# EAGLE design NoteIt (EAGLE 9.6.2)
AUTHOR: Tiago Silva; IGNORE_RENUMBER: TP; SOURCE: github.com/TiagoPaulaSilva/NoteIt; VERSION: 2.0
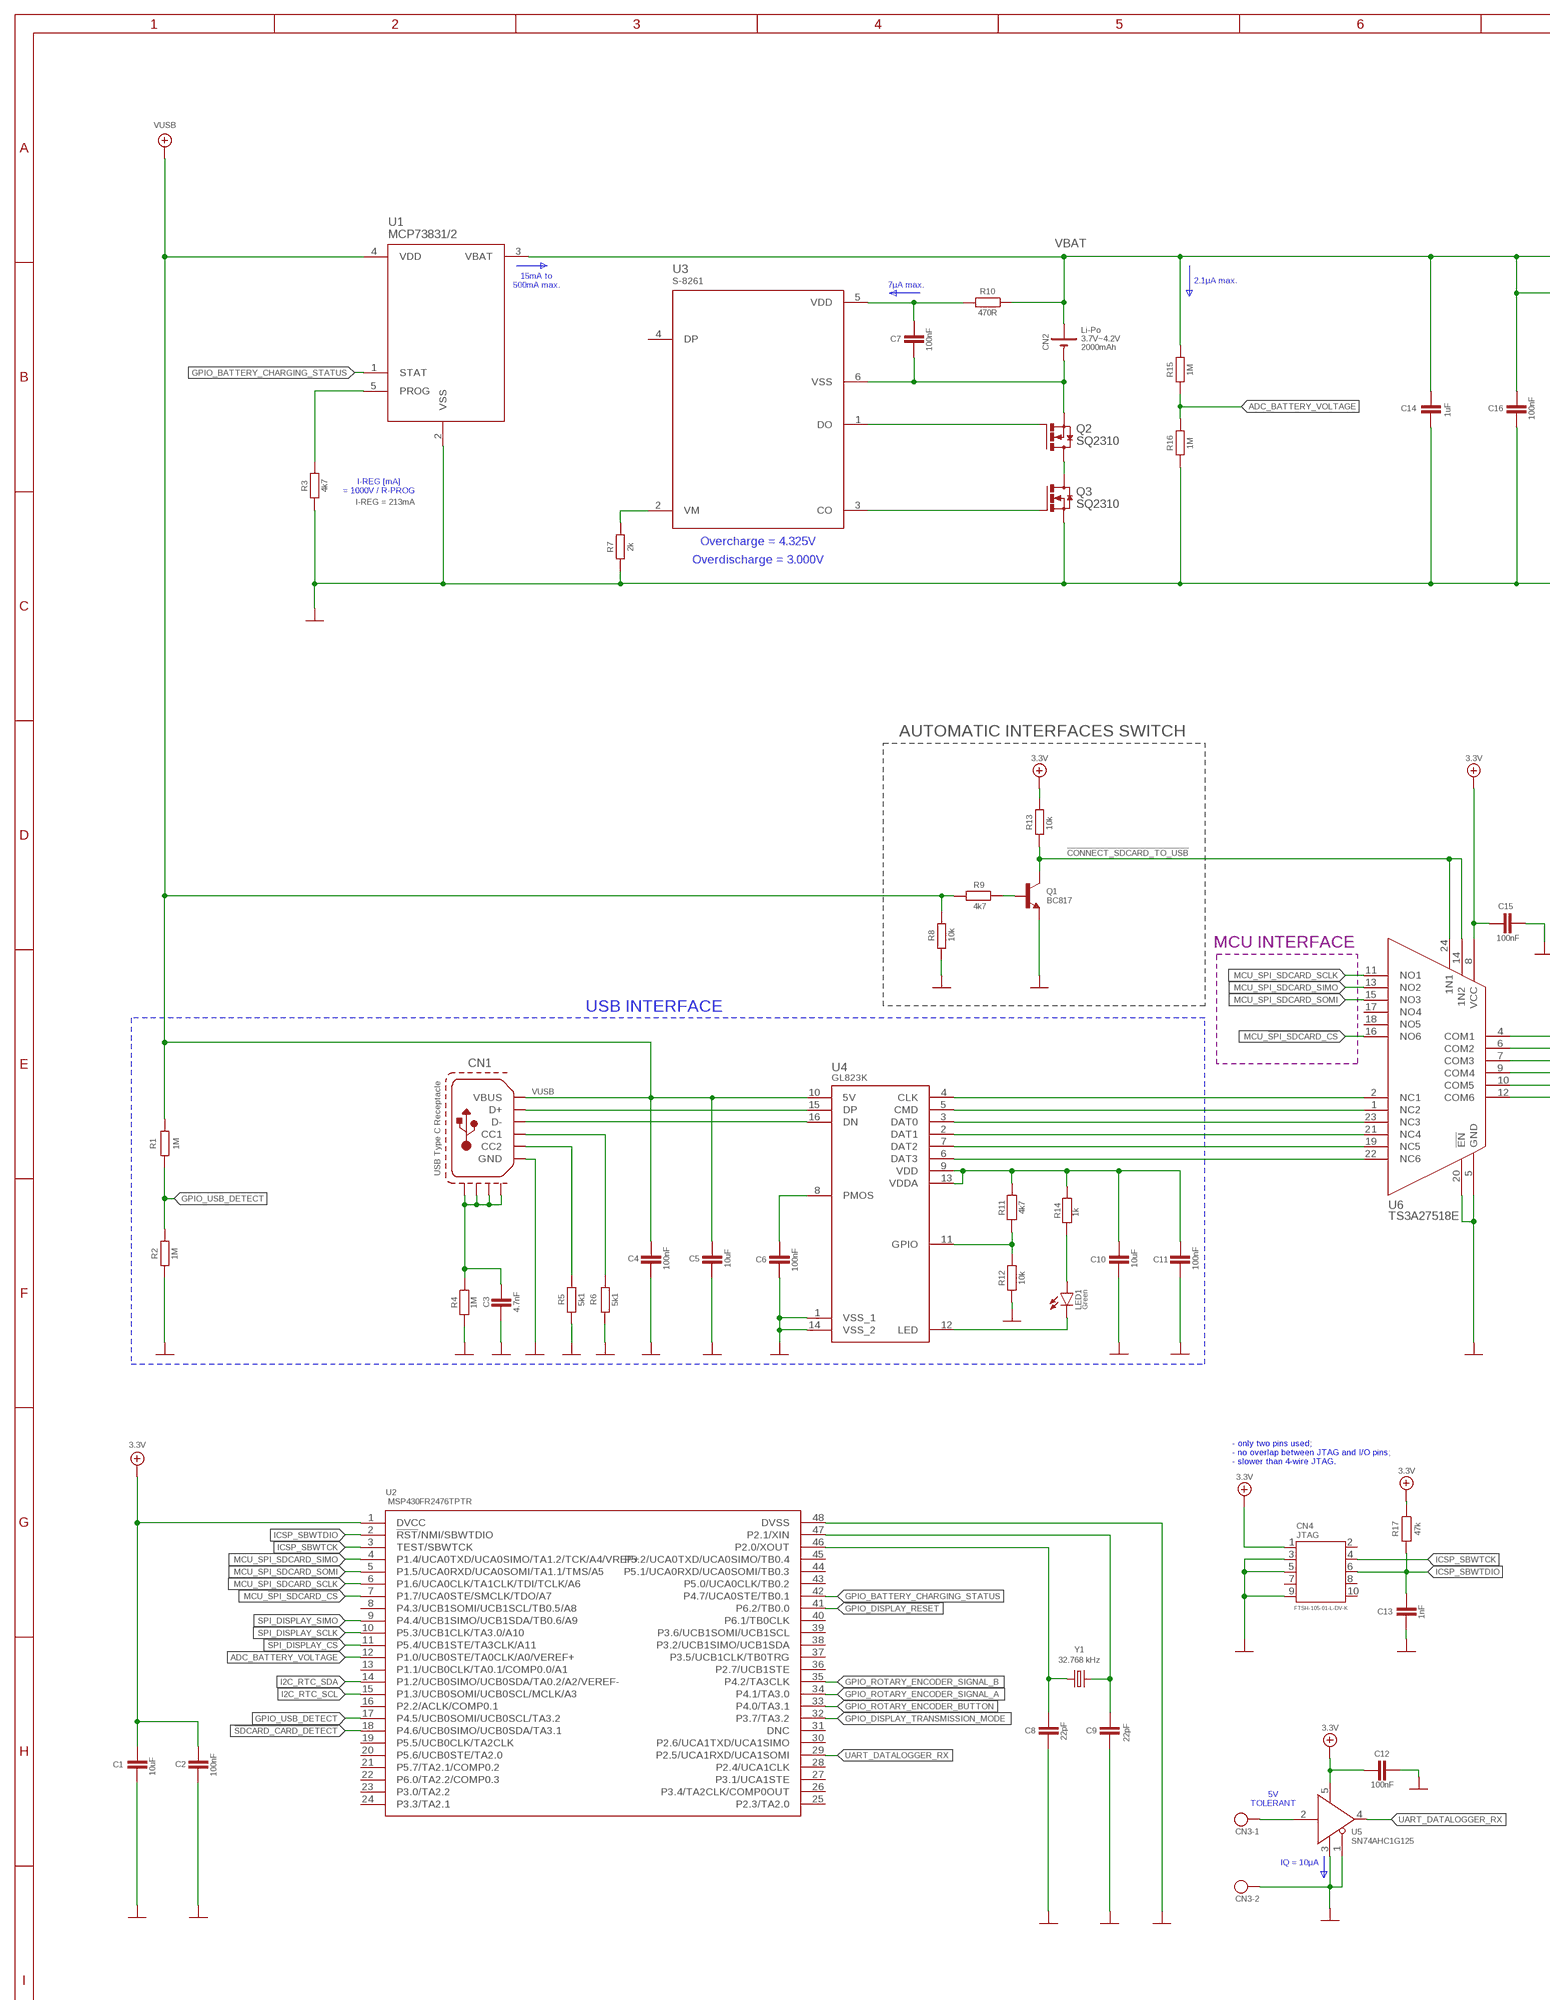
[diagram p0: schematic, sheet 1, part 1 of 2]
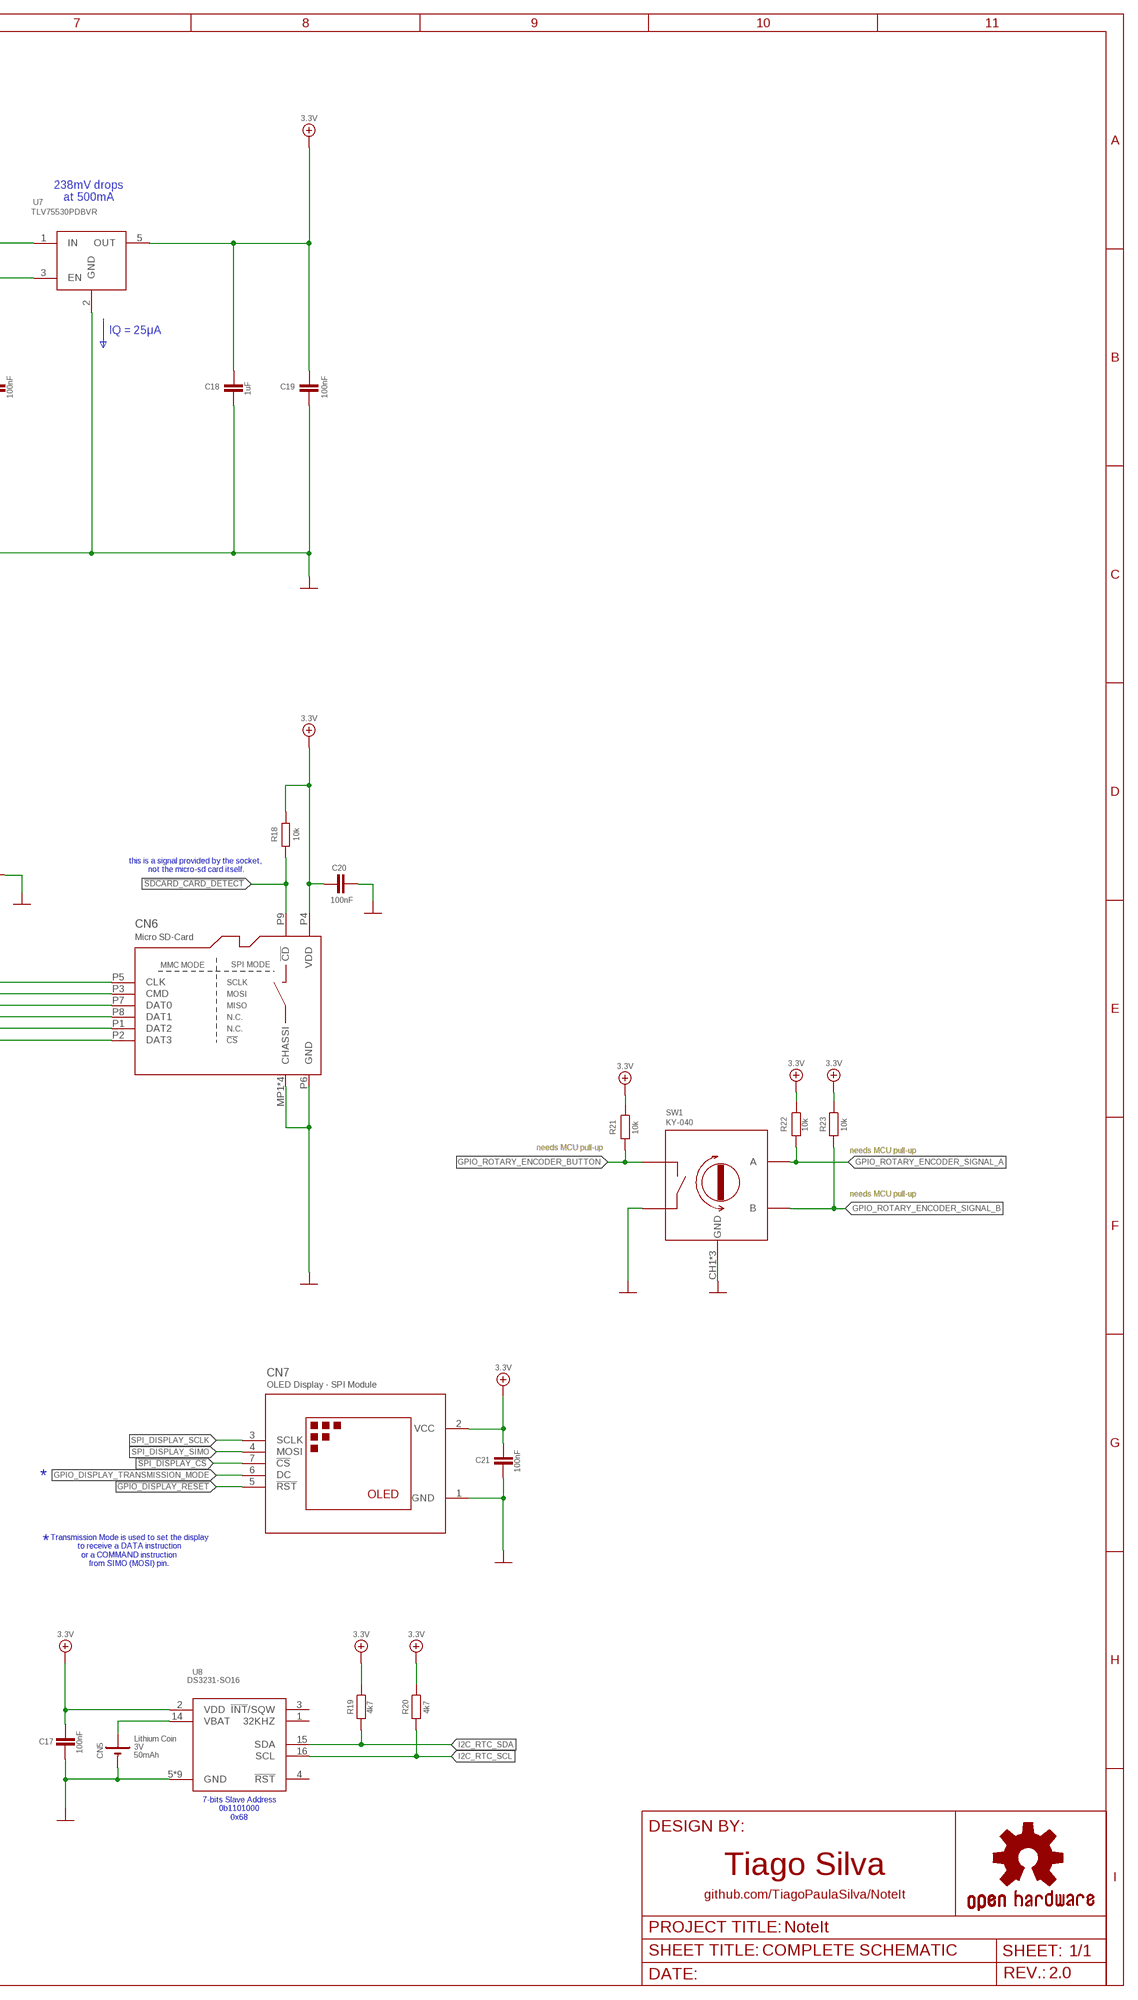
[diagram p1: schematic, sheet 1, part 2 of 2]

## Parts
C1  10uF  C_0603  [C0603]
C2  100nF  C_0603  [C0603]
C3  4.7nF  C_0603  [C0603]
C4  100nF  C_0603  [C0603]
C5  10uF  C_0603  [C0603]
C6  100nF  C_0603  [C0603]
C7  100nF  C_0603  [C0603]
C8  22pF  C_0603  [C0603]
C9  22pF  C_0603  [C0603]
C10  10uF  C_0603  [C0603]
C11  100nF  C_0603  [C0603]
C12  100nF  C_0603  [C0603]
C13  1nF  C_0603  [C0603]
C14  1uF  C_0603  [C0603]
C15  100nF  C_0603  [C0603]
C16  100nF  C_0603  [C0603]
C17  100nF  C_0603  [C0603]
C18  1uF  C_0603  [C0603]
C19  100nF  C_0603  [C0603]
C20  100nF  C_0603  [C0603]
C21  100nF  C_0603  [C0603]
CN1  USB Type C Receptacle  USB-C-16P-2LAYERS  [USB-C-16P-2LAYER-PADS]
CN2  CELL-JST-PH-2P-H  [JST-PH-2P-H]
CN3  2P-BLOCK-3.5MM-2P  [BLOCK-3.5MM-2P]
CN4  JTAG  [JTAG-ARM-10P]
CN5  CR-1225  [CR1220/1225_HOLDER]
CN6  Micro SD-Card  SD-CARD  [SD-CARD]
CN7  OLED-MODULE-SPI-NO_HOLES  [PIN_HEADER_1X7_NH]
LED1  LED-0603  [LED-0603]
Q1  BC817  NPN-BC817  [SOT23-3]
Q2  N-FET-ENHANCEMENT-SQ2310  [SOT23-3]
Q3  N-FET-ENHANCEMENT-SQ2310  [SOT23-3]
R1  1M  R_0603  [R0603]
R2  1M  R_0603  [R0603]
R3  4k7  R_0603  [R0603]
R4  1M  R_0603  [R0603]
R5  5k1  R_0603  [R0603]
R6  5k1  R_0603  [R0603]
R7  2k  R_0603  [R0603]
R8  10k  R_0603  [R0603]
R9  4k7  R_0603  [R0603]
R10  470R  R_0603  [R0603]
R11  4k7  R_0603  [R0603]
R12  10k  R_0603  [R0603]
R13  10k  R_0603  [R0603]
R14  1k  R_0603  [R0603]
R15  1M  R_0603  [R0603]
R16  1M  R_0603  [R0603]
R17  47k  R_0603  [R0603]
R18  10k  R_0603  [R0603]
R19  4k7  R_0603  [R0603]
R20  4k7  R_0603  [R0603]
R21  10k  R_0603  [R0603]
R22  10k  R_0603  [R0603]
R23  10k  R_0603  [R0603]
SW1  KY-040  ROTARY-ENCODER  [KY-040]
U1  MCP73831/2  MCP73831T-2ACI/OT  [SOT-23-5]
U2  MSP430FR2476TPTR  [LQFP-48]
U3  S-8261  [SOT-23-6]
U4  GL823K  [SSOP16]
U5  SN74AHC1G125  [SOT-23-5]
U6  TS3A27518E  [TSSOP-24]
U7  TLV75530PDBVR  [SOT-23-5]
U8  DS3231-SO16  [SOIC-16W_(SO16)]
Y1  32.768 kHz  OSC-32.768KHZ  [3.2MM_1.6MM]

## Nets
0V: C1.2 C2.2 C3.1 C4.1 C5.1 C6.1 C8.2 C9.2 C10.1 C11.1 C12.2 C13.2 C14.2 C15.1 C16.2 C17.1 C18.2 C19.2 C20.1 C21.2 CN1.GND CN1.GND2(GND) CN3.2 CN4.3(GND) CN4.5(GND2) CN4.9(GND3) CN5.- CN6.MP1(CHASSI) CN6.MP2(CHASSI) CN6.MP3(CHASSI) CN6.MP4(CHASSI) CN6.P6(GND) CN7.1(GND) Q1.2(E) Q3.2(S) R2.1 R3.1 R4.2 R5.2 R6.2 R7.1 R8.2 R12.1 R16.1 SW1.CH1(GND) SW1.CH2(GND) SW1.GND SW1.SW2 U1.2(VSS) U2.48(DVSS) U4.1(VSS_1) U4.14(VSS_2) U5.1(!OE) U5.3(GND) U6.5(GND) U6.20(!EN) U7.2(GND) U8.5(GND) U8.6(GND) U8.7(GND) U8.8(GND) U8.9(GND) U8.10(GND) U8.11(GND) U8.12(GND) U8.13(GND)
3.3V: C1.1 C2.1 C12.1 C15.2 C17.2 C18.1 C19.1 C20.2 C21.1 CN4.1(VDD) CN6.P4(VDD) CN7.2(VCC) R13.2 R17.1 R18.1 R19.1 R20.1 R21.1 R22.1 R23.1 U2.1(DVCC) U5.5(VDD) U6.8(VCC) U7.5(OUT) U8.2(VDD)
!CONNECT_SDCARD_TO_USB: Q1.3(C) R13.1 U6.14(1N2) U6.24(1N1)
!GPIO_DISPLAY_RESET: CN7.5(!RST) U2.41(P6.2/TB0.0)
!SDCARD_CARD_DETECT!: CN6.P9(!CD) R18.2 U2.18(P4.6/UCB0SIMO/UCB0SDA/TA3.1)
!SPI_DISPLAY_CS: CN7.7(!CS) U2.11(P5.4/UCB1STE/TA3CLK/A11)
ADC_BATTERY_VOLTAGE: R15.1 R16.2 U2.12(P1.0/UCB0STE/TA0CLK/A0/VEREF+)
GPIO_BATTERY_CHARGING_STATUS: U1.1(STAT) U2.42(P4.7/UCA0STE/TB0.1)
GPIO_DISPLAY_TRANSMISSION_MODE: CN7.6(DC) U2.32(P3.7/TA3.2)
GPIO_ROTARY_ENCODER_BUTTON: R21.2 SW1.SW1 U2.33(P4.0/TA3.1)
GPIO_ROTARY_ENCODER_SIGNAL_A: R22.2 SW1.A U2.34(P4.1/TA3.0)
GPIO_ROTARY_ENCODER_SIGNAL_B: R23.2 SW1.B U2.35(P4.2/TA3CLK)
GPIO_USB_DETECT: R1.1 R2.2 U2.17(P4.5/UCB0SOMI/UCB0SCL/TA3.2)
I2C_RTC_SCL: R20.2 U2.15(P1.3/UCB0SOMI/UCB0SCL/MCLK/A3) U8.16(SCL)
I2C_RTC_SDA: R19.2 U2.14(P1.2/UCB0SIMO/UCB0SDA/TA0.2/A2/VEREF-) U8.15(SDA)
ICSP_SBWTCK: CN4.4(TCK) U2.3(TEST/SBWTCK)
ICSP_SBWTDIO: C13.1 CN4.6(TDO) R17.2 U2.2(!RST!/NMI/SBWTDIO)
MCU_!SPI_SDCARD_CS: U2.7(P1.7/UCA0STE/SMCLK/TDO/A7) U6.16(NO6)
MCU_SPI_SDCARD_SCLK: U2.6(P1.6/UCA0CLK/TA1CLK/TDI/TCLK/A6) U6.11(NO1)
MCU_SPI_SDCARD_SIMO: U2.4(P1.4/UCA0TXD/UCA0SIMO/TA1.2/TCK/A4/VREF+) U6.13(NO2)
MCU_SPI_SDCARD_SOMI: U2.5(P1.5/UCA0RXD/UCA0SOMI/TA1.1/TMS/A5) U6.15(NO3)
N$1: Q2.1(G) U3.1(DO)
N$2: CN6.P5(CLK) U6.4(COM1)
N$3: Q2.3(D) Q3.3(D)
N$4: CN3.1 U5.2(IN)
N$5: LED1.C(K) U4.12(LED)
N$6: CN1.B5(CC2) R5.1
N$7: CN6.P1(DAT2) U6.10(COM5)
N$8: CN6.P2(DAT3) U6.12(COM6)
N$9: LED1.A R14.2
N$10: C3.2 CN1.SHLD1(S1) CN1.SHLD2(S2) CN1.SHLD3(S3) CN1.SHLD4(S4) R4.1
N$11: C10.2 C11.2 R11.1 R14.1 U4.9(VDD) U4.13(VDDA)
N$12: R11.2 R12.2 U4.11(GPIO)
N$13: C6.2 U4.8(PMOS)
N$14: Q1.1(B) R9.1
N$15: CN6.P3(CMD) U6.6(COM2)
N$16: CN6.P7(DAT0) U6.7(COM3)
N$17: CN1.A6(D+) CN1.B6(D+) U4.15(DP)
N$18: CN1.A7(D-) CN1.B7(D-) U4.16(DN)
N$19: CN1.A5(CC1) R6.1
N$20: CN6.P8(DAT1) U6.9(COM4)
N$22: CN5.+ U8.14(VBAT)
N$26: R3.2 U1.5(PROG)
N$27: Q3.1(G) U3.3(CO)
N$29: R7.2 U3.2(VM)
N$31: C7.1 R10.2 U3.5(VDD)
N$32: C7.2 CN2.2(-) Q2.2(S) U3.6(VSS)
SPI_DISPLAY_SCLK: CN7.3(SCLK) U2.10(P5.3/UCB1CLK/TA3.0/A10)
SPI_DISPLAY_SIMO: CN7.4(MOSI) U2.9(P4.4/UCB1SIMO/UCB1SDA/TB0.6/A9)
UART_DATALOGGER_RX: U2.29(P2.5/UCA1RXD/UCA1SOMI) U5.4(OUT)
USB_CLK: U4.4(CLK) U6.2(NC1)
USB_CMD: U4.5(CMD) U6.1(NC2)
USB_DAT0: U4.3(DAT0) U6.23(NC3)
USB_DAT1: U4.2(DAT1) U6.21(NC4)
USB_DAT2: U4.7(DAT2) U6.19(NC5)
USB_DAT3: U4.6(DAT3) U6.22(NC6)
VBAT: C14.1 C16.1 CN2.1(+) R10.1 R15.2 U1.3(VBAT) U7.1(IN) U7.3(EN)
VUSB: C4.2 C5.2 CN1.VBUS1(VBUS) CN1.VBUS2(VBUS) R1.2 R8.1 R9.2 U1.4(VDD) U4.10(5V)
XTAL_IN: C8.1 U2.46(P2.0/XOUT) Y1.1
XTAL_OUT: C9.1 U2.47(P2.1/XIN) Y1.2
Unconnected: CN4.2(TMS) CN4.7 CN4.8(TDI) CN4.10(!RST) U2.8(P4.3/UCB1SOMI/UCB1SCL/TB0.5/A8) U2.13(P1.1/UCB0CLK/TA0.1/COMP0.0/A1) U2.16(P2.2/ACLK/COMP0.1) U2.19(P5.5/UCB0CLK/TA2CLK) U2.20(P5.6/UCB0STE/TA2.0) U2.21(P5.7/TA2.1/COMP0.2) U2.22(P6.0/TA2.2/COMP0.3) U2.23(P3.0/TA2.2) U2.24(P3.3/TA2.1) U2.25(P2.3/TA2.0) U2.26(P3.4/TA2CLK/COMP0OUT) U2.27(P3.1/UCA1STE) U2.28(P2.4/UCA1CLK) U2.30(P2.6/UCA1TXD/UCA1SIMO) U2.31(DNC) U2.36(P2.7/UCB1STE) U2.37(P3.5/UCB1CLK/TB0TRG) U2.38(P3.2/UCB1SIMO/UCB1SDA) U2.39(P3.6/UCB1SOMI/UCB1SCL) U2.40(P6.1/TB0CLK) U2.43(P5.0/UCA0CLK/TB0.2) U2.44(P5.1/UCA0RXD/UCA0SOMI/TB0.3) U2.45(P5.2/UCA0TXD/UCA0SIMO/TB0.4) U3.4(DP) U6.17(NO4) U6.18(NO5) U8.1(32KHZ) U8.3(!INT!/SQW) U8.4(!RST!)

## Notes on the sheet
- 238mV drops
  at 500mA
- 15mA to
  500mA max.
- 2.1μA max.
- 7μA max.
- IQ = 25μA
- I-REG [mA]
  = 1000V / R-PROG
- I-REG = 213mA
- Overcharge = 4.325V
- Overdischarge = 3.000V
- AUTOMATIC INTERFACES SWITCH
- this is a signal provided by the socket, 
  not the micro-sd card itself.
- MCU INTERFACE
- USB INTERFACE
- needs MCU pull-up
- needs MCU pull-up
- needs MCU pull-up
- - only two pins used;
  - no overlap between JTAG and I/O pins;
  - slower than 4-wire JTAG.
- *
- *
- Transmission Mode is used to set the display
  to receive a DATA instruction
  or a COMMAND instruction
  from SIMO (MOSI) pin.
- 5V
  TOLERANT
- IQ = 10μA
- 7-bits Slave Address
  0b1101000
  0x68

## Library data of the parts
C1 = My-RLC:C_: NON-POLARIZED CAP; PARTNO: *; PN: GRM188R61A106ME69D
C2 = My-RLC:C_: NON-POLARIZED CAP; PARTNO: *; PN: C0603C104M5RACTU
C3 = My-RLC:C_: NON-POLARIZED CAP; PARTNO: *; PN: test
C4-C7 C10 C11 C14-C21 = My-RLC:C_: NON-POLARIZED CAP; PARTNO: *
C8 C9 = My-RLC:C_: NON-POLARIZED CAP; PARTNO: *; PN: C0603C220J1GACTU
C12 C13 = My-RLC:C_: NON-POLARIZED CAP; PARTNO: *; PN: C0603C102M5RACTU
CN1 = My-Connectors:USB-C-16P: USB Type C 16Pin Connector Super Speed pins not available on the 16-pin purely SMD connector so this part is best for USB 2.0 implementations. D1 and D2 are tied together enabling D+/- no matter which way the cable is plugged into the connector. The two channel configuration pins (CC1/2) are exposed. These are normally connected to ground via 5.1k resistors but can be reconfigured for high current/high power applications. **4-LAYER BOARD WARNING!!** If designing 4-layer board, make sure to select the variant _4-LAYER-ISOLATED. The linked footprint (USB-C-16-4LAYER-ISOLATED) includes some very necessary cutout polygons in the inner layers (2 and 15). This prevents the PTH mounting shield legs on the USB connector from electrically connecting any other polygons on the inner layers (usually VCC and GND).; PN: USB4105-GF-A
CN2 = My-Battery:CELL-; CAPACITY: 2000mAh; TYPE: Li-Po; VOLTAGE: 3.7V~4.2V
CN3 = My-Connectors:2P-: KK Plus 396 Header Current - Maximum per Contact 11.0A Voltage - Maximum 350V AC/DC Pitch - Mating Interface 3.96mm Vertical Fully Shrouded; PN: 691103110002
CN4 = My-Connectors:JTAG; PN: FTSH-105-01-L-DV-K
CN5 = My-Battery:CR-; CAPACITY: 50mAh; PARTNO: *; PN: 1072; TYPE: Lithium Coin; VOLTAGE: 3V
CN6 = My-Sockets:SD-CARD: Micro SD-Card Connector; PARTNO: *; PN: MEM2075-00-140-01-A
CN7 = My-Displays:OLED-MODULE-SPI; FAMILY: OLED Display - SPI Module; PARTNO: *
LED1 = My-LEDs:LED: LED (Generic) Standard schematic elements and footprints for 5mm, 3mm, 1206, and 0603 sized LEDs. Generic LEDs with no color specified.; FAMILY: Green; PN: 150060VS75000
Q1 = My-Transistors:NPN-: Bipolar Junction Transistor - NPN; FAMILY: BC817; IC: 500mA; PARTNO: *; PN: BC817-25,215; VCE: 700mV; VCEO: 45V
Q2 Q3 = My-Transistors:N-FET-ENHANCEMENT-; FAMILY: SQ2310; ID: 6A; PARTNO: *; PD: 2W; PN: SQ2310ES-T1_GE3; RDS: 24 mOhms; VDS: 20V; VGS: ±8V
R1-R16 R18 = My-RLC:R_: RESISTOR; PARTNO: *
R17 R19-R23 = My-RLC:R_: RESISTOR; PARTNO: *; PN: RC0603JR-1047KL
SW1 = My-Electromechanicals:ROTARY-ENCODER; PARTNO: *; PN: KY-040
U1 = My-ICs:MCP73831: MCP73831/2 Miniature Single-Cell, Fully Integrated Li-Ion, Li-Polymer Charge Management Controllers. Nice and small simple lipoly charge controller, with adjustable current and status output (LED) http://www.ladyada.net/library/pcb/eaglelibrary.html; PARTNO: *; PN: MCP73831T-2ACI/OT
U2 = My-Microcontrollers:MSP430FR2476: 16 MHz ultra-low-power microcontroller with 64 KB FRAM, 8 KB RAM, 12-bit ADC, 43 IO, 5 16-bit timers Source: Datasheet <http://www.ti.com/lit/gpn/MSP430FR2476>; DESCRIPTION: 16 MHz ultra-low-power microcontroller with 64 KB FRAM, 8 KB RAM, 12-bit ADC, 43 IO, 5 16-bit timers; HEIGHT: 1.6mm; MANUFACTURER_NAME: Texas Instruments; MOUSER_PART_NUMBER: 595-MSP430FR2476TPTR; MOUSER_PRICE-STOCK: https://www.mouser.co.uk/ProductDetail/Texas-Instruments/MSP430FR2476TPTR?qs=vLWxofP3U2yi4%2F%252BXDj0bzg%3D%3D; PARTNO: *; PN: MSP430FR2476TPTR
U3 = My-ICs:S-8261: Battery 1-Cell Overcharge/Overdischarge Protection; PARTNO: *; PN: S-8261ACMMD-G4MT2U; SPICEPREFIX: X
U4 = My-ICs:GL823K: SD-Card to USB 2.0 Reader Source: Datasheet <http://www.electrodragon.com/w/images/c/cb/GL823K.pdf>; PARTNO: *; PN: GL823K
U5 = My-ICs:SN74AHC1G125: Single buffer with 3-state output; PARTNO: *; PN: SN74AHC1G125DBVT
U6 = My-ICs:TS3A27518E: 1:2 MUX/DEMUX - 6 channels (digital and analog signals); PARTNO: *; PN: TS3A27518EPWR
U7 = My-LDOs:TLV755: TLV755P 500-mA, Low IQ, Small Size, Low Dropout Regulator; PARTNO: *; PN: TLV75530PDBVR
U8 = My-ICs:DS3231: Extremely Accurate I2C-Integrated RTC/TCXO/Crystal; PARTNO: *; PN: DS3231SN#
Y1 = My-Crystals:OSC-: Crystals 25MHz Initial Freq Tol. = 30ppm Source: Datasheet <https://www.murata.com/products/productdata/8801076772894/SPEC-XRCGB25M000F3N00R0.pdf?1517925606000>; PARTNO: *; PN: CM7V-T1A-32.768k-9pF-20PPM-TA-QA T3

## Net classes
2 gnd: width 0.305 mm, drill 0.559 mm, clearance 0.254 mm

## Board
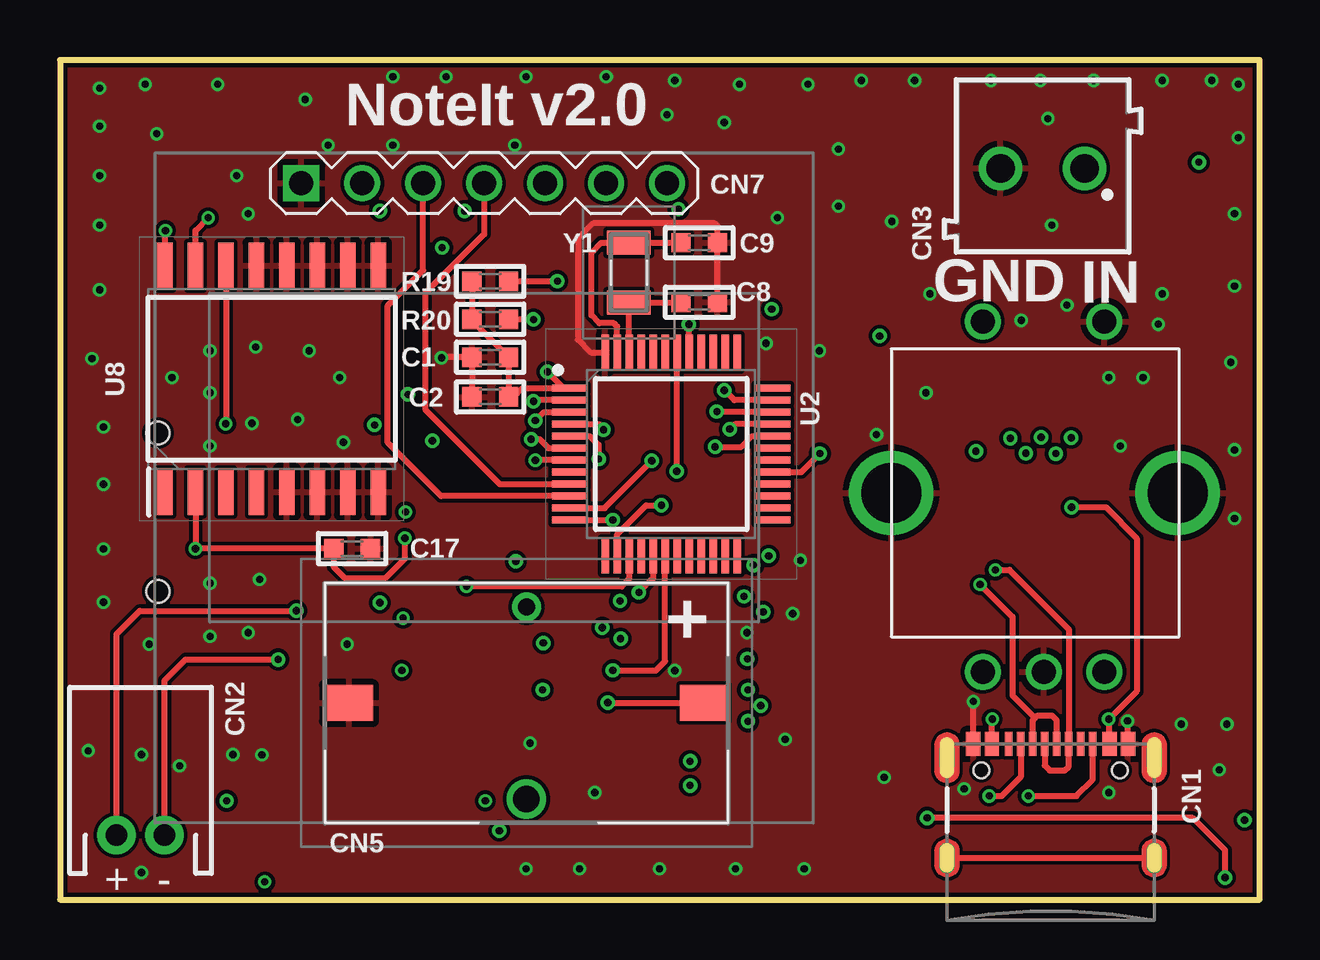
[diagram p2: board, top side]
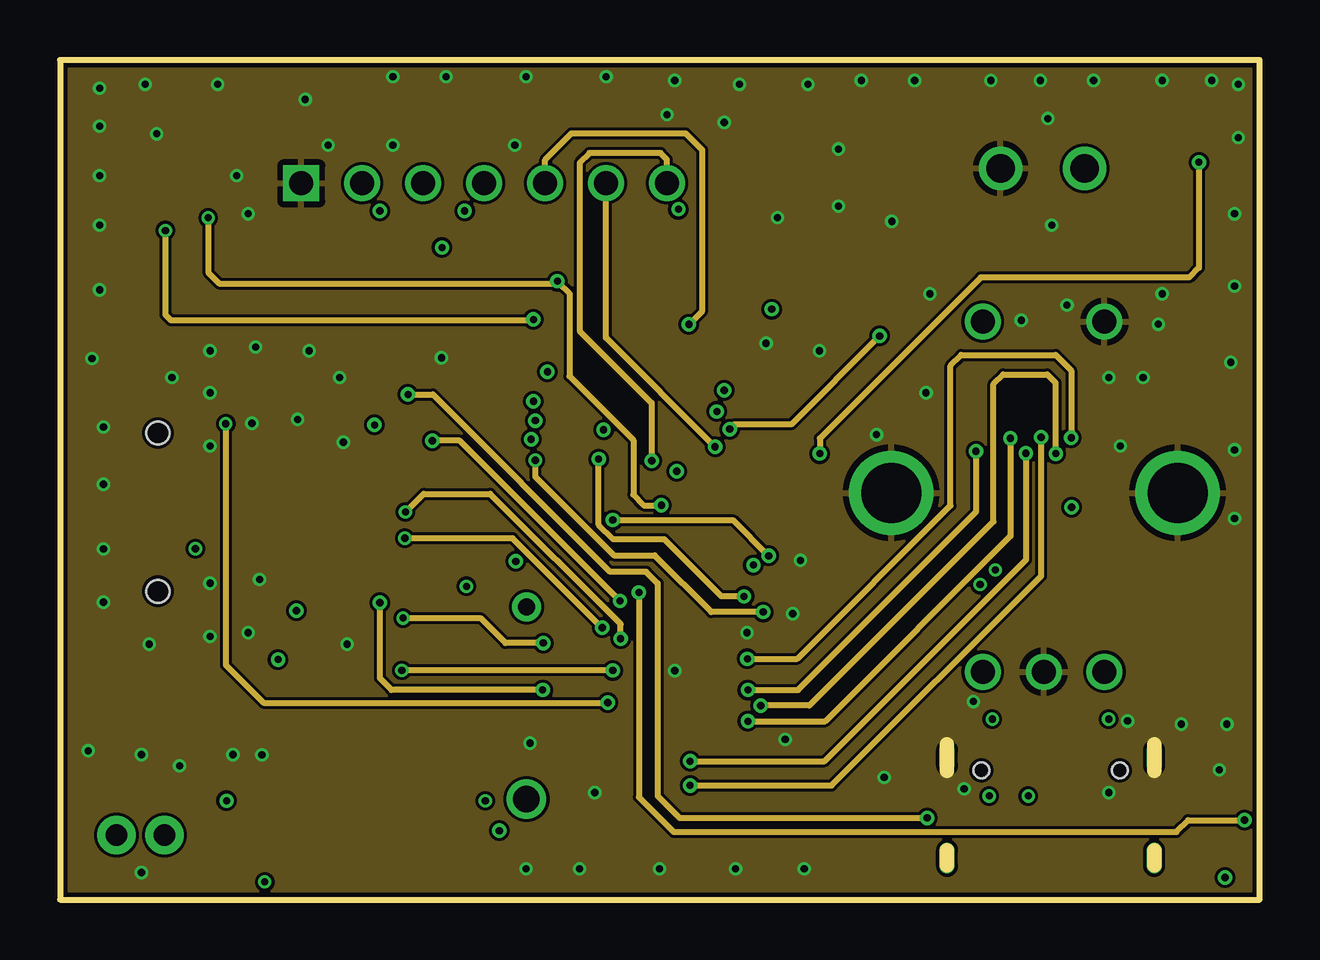
[diagram p3: board, inner layer Route2]
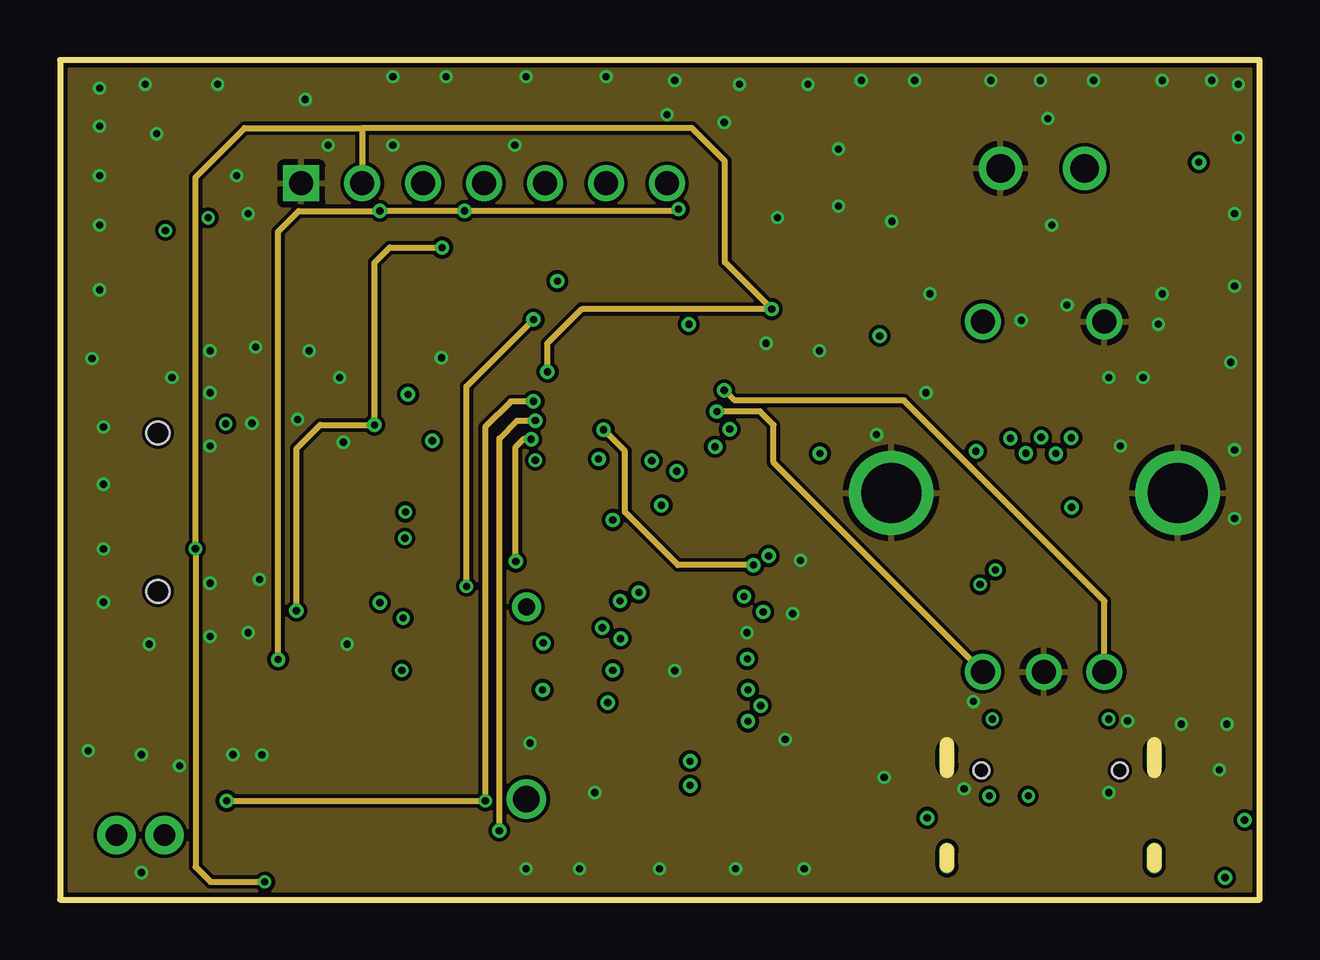
[diagram p4: board, inner layer Route15]
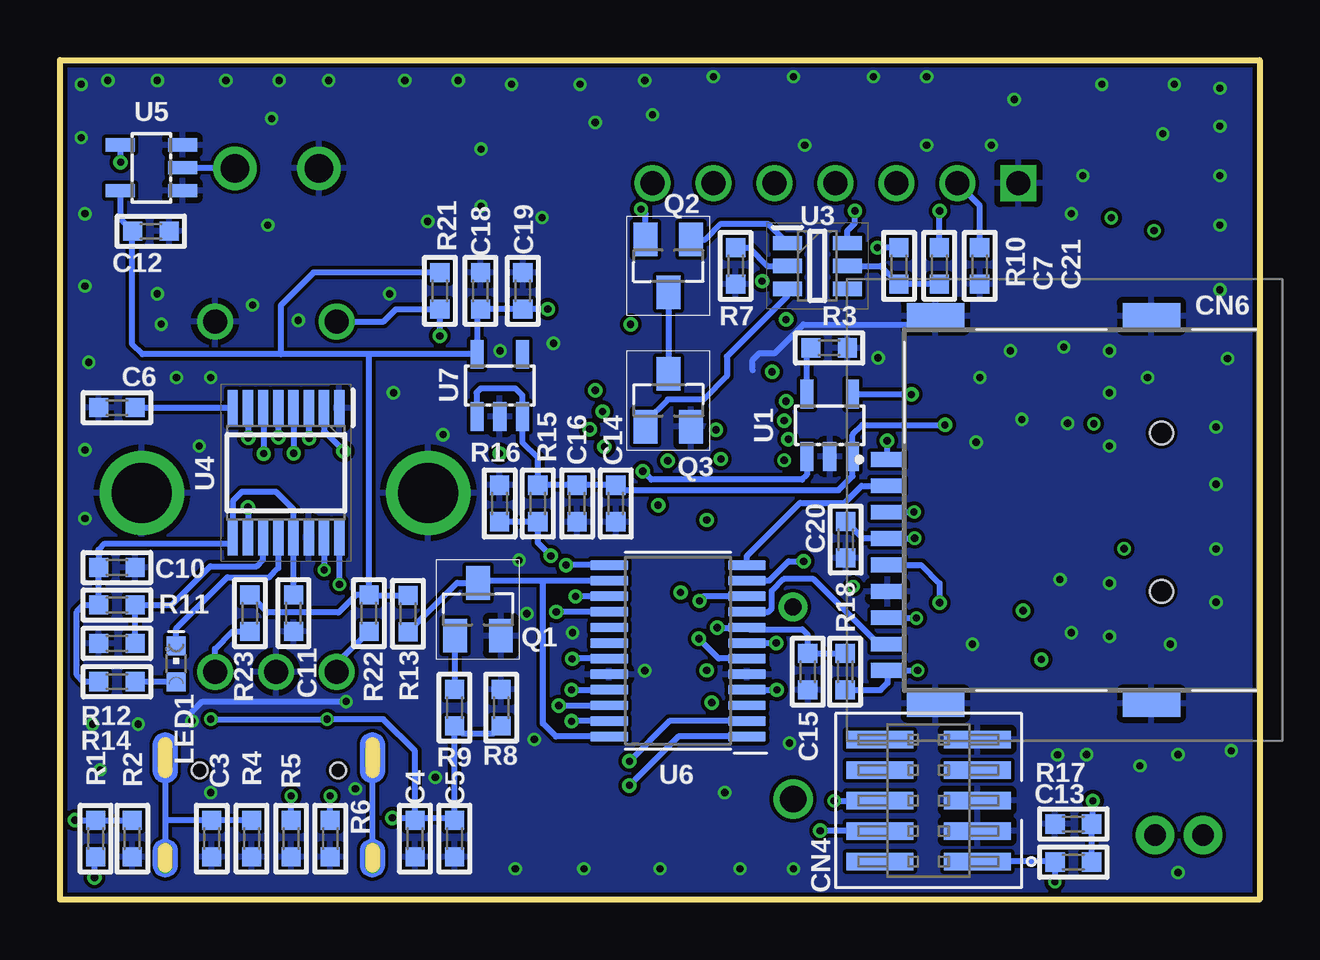
[diagram p5: board, bottom side, seen from below]

Size 50 x 35 mm. Coordinates in mm from the lower left corner, seen from the top.
Outline: 0,0 50,0 50,35 0,35 0,0
Copper layers (1*2*15*16): Top 0.035559375mm / dielectric 0.47751875mm / Route2 0.035559375mm / dielectric 0.47751875mm / Route15 0.035559375mm / dielectric 0.47751875mm / Bottom 0.035559375mm
Design rules "SparkFun-4-Layer-Minimum-JLCPCB": minimum track width 5mil, minimum drill 0.2mm, track to track 5mil, track to pad 5mil, pad to pad 5mil, via to via 5mil, smd to smd 5mil, copper to edge 7mil, drill to drill 7mil, minimum pad ring 5mil, minimum via ring 5mil, stop-mask expansion 2.5mil, vias tented up to drill 25mil, thermal gap 10mil

### Footprints (pad centres in the part's own frame; a part is rotated, then mirrored left to right if it is on the bottom)
C0603 = smd 0.8 x 0.8: 1 -0.762,0; 2 0.762,0
USB-C-16P-2LAYER-PADS = smd 0.3 x 1: A5 -1.25,-0.34; A6 -0.25,-0.34; A7 0.25,-0.34; A8 1.25,-0.34; B5 1.75,-0.34; B6 0.75,-0.34; B7 -0.75,-0.34; B8 -1.75,-0.34 | smd 0.6 x 1: GND -3.225,-0.34; GND2 3.225,-0.34; VBUS1 -2.45,-0.34; VBUS2 2.45,-0.34 | drill 0.4 pad 0.6 long: SHLD1 -4.318,-0.915; SHLD2 4.318,-0.915; SHLD3 -4.318,-5.095; SHLD4 4.318,-5.095 | hole 0.65: -2.89,-1.445; 2.89,-1.445
JST-PH-2P-H = drill 0.9 pad 1.6: 1 -1,0; 2 1,0
BLOCK-3.5MM-2P = drill 1.2: 1 -1.75,0; 2 1.75,0
JTAG-ARM-10P = smd 0.74 x 2.79: 1 -2.54,-2.032; 2 -2.54,2.032; 3 -1.27,-2.032; 4 -1.27,2.032; 5 0,-2.032; 6 0,2.032; 7 1.27,-2.032; 8 1.27,2.032; 9 2.54,-2.032; 10 2.54,2.032
CR1220/1225_HOLDER = smd 1.5 x 2: + 0,-7.4; - 0,7.4 | drill 0.7 pad 1.2: MH1 4,0 | drill 1.1 pad 1.65: MH2 -4,0
SD-CARD = smd 1.1 x 2.4: MP1 -8.075,5.725; MP2 -8.075,-3.275; MP3 8.075,-3.275; MP4 8.075,5.725 | smd 0.62 x 1.4: P1 2.105,7.725; P2 1.005,7.725; P3 -0.095,7.725; P4 -1.195,7.725; P5 -2.295,7.725; P6 -3.395,7.725; P7 -4.495,7.725; P8 -5.595,7.725; P9 -6.695,7.725 | hole 0.95: -3.395,-3.695; 3.205,-3.695
PIN_HEADER_1X7_NH = drill 1 square: 1 -7.62,12.7 | drill 1: 2 -5.08,12.7; 3 -2.54,12.7; 4 0,12.7; 5 2.54,12.7; 6 5.08,12.7; 7 7.62,12.7
LED-0603 = smd 0.8 x 0.8: A 0,-0.75; C 0,0.75
SOT23-3 = smd 1 x 1.4: 1 -0.95,-1.1; 2 0.95,-1.1; 3 0,1.1
R0603 = smd 0.8 x 0.8: 1 -0.762,0; 2 0.762,0
KY-040 = drill 1: A 2.54,7.8; B -2.54,7.8; GND 0,7.8; SW1 2.54,-6.8; SW2 -2.54,-6.8 | drill 2.5: CH1 6.35,0.35; CH2 -5.588,0.35
SOT-23-5 = smd 0.55 x 1.2: 1 -0.95,-1.3; 2 0,-1.3; 3 0.95,-1.3; 4 0.95,1.3; 5 -0.95,1.3
LQFP-48 = smd 1.475 x 0.3: 1 -4.238,2.75; 2 -4.238,2.25; 3 -4.238,1.75; 4 -4.238,1.25; 5 -4.238,0.75; 6 -4.238,0.25; 7 -4.238,-0.25; 8 -4.238,-0.75; 9 -4.238,-1.25; 10 -4.238,-1.75; 11 -4.238,-2.25; 12 -4.238,-2.75; 25 4.238,-2.75; 26 4.238,-2.25; 27 4.238,-1.75; 28 4.238,-1.25; 29 4.238,-0.75; 30 4.238,-0.25; 31 4.238,0.25; 32 4.238,0.75; 33 4.238,1.25; 34 4.238,1.75; 35 4.238,2.25; 36 4.238,2.75 | smd 0.3 x 1.475: 13 -2.75,-4.238; 14 -2.25,-4.238; 15 -1.75,-4.238; 16 -1.25,-4.238; 17 -0.75,-4.238; 18 -0.25,-4.238; 19 0.25,-4.238; 20 0.75,-4.238; 21 1.25,-4.238; 22 1.75,-4.238; 23 2.25,-4.238; 24 2.75,-4.238; 37 2.75,4.238; 38 2.25,4.238; 39 1.75,4.238; 40 1.25,4.238; 41 0.75,4.238; 42 0.25,4.238; 43 -0.25,4.238; 44 -0.75,4.238; 45 -1.25,4.238; 46 -1.75,4.238; 47 -2.25,4.238; 48 -2.75,4.238
SOT-23-6 = smd 1.2 x 0.6: 1 -1.25,0.95; 2 -1.25,0; 3 -1.25,-0.95; 4 1.25,-0.95; 5 1.25,0; 6 1.25,0.95
SSOP16 = smd 1.5 x 0.435: 1 -2.7,2.222; 2 -2.7,1.588; 3 -2.7,0.952; 4 -2.7,0.318; 5 -2.7,-0.318; 6 -2.7,-0.952; 7 -2.7,-1.588; 8 -2.7,-2.222; 9 2.7,-2.222; 10 2.7,-1.588; 11 2.7,-0.952; 12 2.7,-0.318; 13 2.7,0.318; 14 2.7,0.952; 15 2.7,1.588; 16 2.7,2.222
TSSOP-24 = smd 1.57 x 0.41: 1 -2.87,3.575; 2 -2.87,2.925; 3 -2.87,2.275; 4 -2.87,1.625; 5 -2.87,0.975; 6 -2.87,0.325; 7 -2.87,-0.325; 8 -2.87,-0.975; 9 -2.87,-1.625; 10 -2.87,-2.275; 11 -2.87,-2.925; 12 -2.87,-3.575; 13 2.87,-3.575; 14 2.87,-2.925; 15 2.87,-2.275; 16 2.87,-1.625; 17 2.87,-0.975; 18 2.87,-0.325; 19 2.87,0.325; 20 2.87,0.975; 21 2.87,1.625; 22 2.87,2.275; 23 2.87,2.925; 24 2.87,3.575
SOIC-16W_(SO16) = smd 1.925 x 0.65: 1 -4.712,4.445; 2 -4.712,3.175; 3 -4.712,1.905; 4 -4.712,0.635; 5 -4.712,-0.635; 6 -4.712,-1.905; 7 -4.712,-3.175; 8 -4.712,-4.445; 9 4.712,-4.445; 10 4.712,-3.175; 11 4.712,-1.905; 12 4.712,-0.635; 13 4.712,0.635; 14 4.712,1.905; 15 4.712,3.175; 16 4.712,4.445
3.2MM_1.6MM = smd 1 x 1.8: 1 -1.25,0; 2 1.25,0

### Placement (x,y rotation side)
C1  17.93,22.61 180 top
C2  17.93,20.95 180 top
C3  43.67,2.54 90 bottom
C4  35.2,2.54 90 bottom
C5  33.55,2.54 90 bottom
C6  47.62,20.51 0 bottom
C7  13.35,26.42 90 bottom
C8  26.64,24.9 0 top
C9  26.64,27.38 0 top
C10  47.62,13.84 180 bottom
C11  40.27,11.94 90 bottom
C12  46.21,27.86 0 bottom
C13  7.76,3.15 180 bottom
C14  26.83,16.51 270 bottom
C15  18.83,9.5 90 bottom
C16  28.45,16.51 270 bottom
C17  12.18,14.63 180 top
C18  32.48,25.37 90 bottom
C19  30.7,25.37 90 bottom
C20  17.25,15 90 bottom
C21  11.66,26.42 270 bottom
CN1  41.29,6.83 0 top
CN2  3.36,2.69 0 top
CN3  40.96,30.48 180 top
CN4  13.8,4.13 90 bottom
CN5  19.45,8.19 90 top
CN6  7.78,16.24 90 bottom
CN7  17.68,17.16 0 top
LED1  45.15,9.82 0 bottom
Q1  32.58,12.1 0 bottom
Q2  24.64,26.42 180 bottom
Q3  24.64,20.81 0 bottom
R1  48.51,2.54 270 bottom
R2  46.99,2.54 90 bottom
R3  17.94,23 180 bottom
R4  42.01,2.54 270 bottom
R5  40.37,2.54 270 bottom
R6  38.73,2.54 270 bottom
R7  21.84,26.42 90 bottom
R8  31.61,8 90 bottom
R9  33.55,8 270 bottom
R10  15.03,26.42 270 bottom
R11  47.62,12.28 0 bottom
R12  47.62,10.68 0 bottom
R13  35.49,11.91 90 bottom
R14  47.62,9.08 0 bottom
R15  30.08,16.51 90 bottom
R16  31.67,16.51 270 bottom
R17  7.76,1.56 0 bottom
R18  17.27,9.5 270 bottom
R19  17.93,25.77 0 top
R20  17.93,24.19 0 top
R21  34.16,25.37 270 bottom
R22  37.12,11.94 270 bottom
R23  42.08,11.94 270 bottom
SW1  41,17.3 180 top
U1  17.91,19.77 0 bottom
U2  25.48,18.57 0 top
U3  18.43,26.42 0 bottom
U4  40.58,17.79 270 bottom
U5  46.19,30.5 90 bottom
U6  24.23,10.37 180 bottom
U7  31.67,21.43 0 bottom
U8  8.82,21.71 90 top
Y1  23.71,26.14 90 top

### Tracks (layer width: path | path; a pad name or v marks a point on that pad's centre or on a via)
0V  (via drill 0.3 pad 0.5)
  Top 0.254: C8.2 C9.2 27.41,28.07 27.28,28.19 22.23,28.19 21.59,27.56 21.59,23.34 22.12,22.81 U2.48 | C2.2 C1.2 15.93,22.61 v15.9,22.58 | CN1.GND v38.07,8.25 v38.08,8.26 | CN1.GND2 44.52,7.42 v44.5,7.44
  Bottom 0.254: 21.13,22.06 21.13,22.5 20.85,22.78 20.21,22.78 19.01,23.98 14.53,23.98 | v38.08,8.26 44.07,8.26 44.5,7.82 v44.5,7.44
  other vias: 8.41,6.03 3.4,6.05 4.98,5.57 7.21,6.05 1.17,6.2 1.81,12.4 3.71,10.65 7.84,11.13 11.97,10.65 8.32,13.35 1.81,14.62 1.81,17.32 1.81,19.7 1.33,22.56 1.65,25.41 1.65,28.11 1.65,30.18 1.65,32.24 1.65,33.83 3.56,33.99 6.57,33.99 4.03,31.92 7.37,30.18 11.65,21.76 4.67,21.76 9.91,20.02 8.16,23.03 29.91,28.43 34.67,28.27 10.22,33.35 13.87,34.3 16.1,34.3 19.43,34.3 18.95,31.45 13.87,31.45 11.18,31.45 22.76,34.3 25.62,34.14 25.3,32.72 27.69,32.4 28.32,33.99 31.18,33.99 33.4,34.14 35.62,34.14 38.8,34.14 40.86,34.14 43.08,34.14 45.94,34.14 48.01,34.14 49.12,33.99 49.12,31.76 48.96,28.59 48.96,25.57 48.8,22.4 45.78,23.98 45.94,25.25 41.34,28.11 41.18,32.56 32.45,31.29 36.1,21.13 36.26,25.25 40.07,24.14 41.97,24.78 45.15,21.76 44.2,18.9 48.96,18.75 48.96,15.89 48.64,7.32 48.32,5.41 46.74,7.32 31.02,1.28 28.16,1.28 24.99,1.28 21.65,1.28 19.43,1.28 22.29,4.46 19.59,6.52 3.4,1.12 34.35,5.09 30.23,6.68 30.86,14.14 30.54,11.92 28.64,11.13 25.62,9.54 29.43,23.19 31.65,22.87 34.04,19.38 7.84,28.59 6.25,13.19 6.25,10.97 6.25,21.13 6.25,18.9 6.25,22.87 8,19.86 11.81,19.06 10.38,22.87 43.72,21.76 43.72,4.46 37.69,4.62 32.45,28.91
  pour Top (isolate 0.152): 0,-0.08 0,34.98 50.01,34.98 50.01,0 0.08,0
  pour Bottom (isolate 0.152): 0.05,0.13 0.05,35.05 50.01,35.05 50.01,0.13
  pour Route2: -0.05,0 -0.05,34.98 50.06,34.98 50.06,0
  pour Route15 (isolate 0.152): 0.1,0 0.1,34.98 50.01,34.98 50.01,-0.08 0.18,-0.08
3.3V  (via drill 0.3 pad 0.5, 0.3 pad 0.6)
  Top 0.254: R19.1 R20.1 17.17,24.13 C1.1 C2.1 18.9,20.95 19.27,21.32 U2.1 20.99,21.32 v20.32,22 | U8.2 v5.65,14.62 v5.66,14.63 C17.2 11.42,13.86 11.86,13.41 13.56,13.41 14.38,14.22 v14.38,15.06
  Route2 0.254: v22.6,11.33 18.87,15.06 v14.38,15.06
  Route15 0.254: 12.6,32.16 CN7.2 | 12.6,32.16 7.7,32.16 5.65,30.11 v5.65,14.62 5.65,1.36 6.27,0.74 v8.53,0.74 | v20.32,22 20.32,23.19 21.74,24.61 v29.67,24.61 27.71,26.57 27.71,30.79 26.34,32.16 12.6,32.16
  Bottom 0.254: R22.1 37.09,12.68 R13.2 | R22.1 37.65,12.7 38.39,11.96 41.34,11.96 R23.1 | C21.1 11.66,28.92 CN7.2 | R22.1 37.12,22.73 | v29.67,24.61 C19.1 C18.1 32.62,24.47 U7.5 37.12,22.73 | U5.5 47.49,28.38 C12.1 46.99,27.84 46.99,23.16 46.56,22.73 40.8,22.73 | R18.1 C15.2 18.83,11.04 19.06,11.27 21.29,11.27 U6.8 21.38,11.33 v22.6,11.33 | CN4.1 8.55,1.59 R17.1 v8.52,0.75 v8.53,0.74 | 37.12,22.73 40.8,22.73 | v14.38,15.06 14.39,15.05 CN6.P4 16.53,15.05 C20.2 | R21.1 39.43,26.14 40.8,24.77 40.8,22.73
!CONNECT_SDCARD_TO_USB
  Bottom 0.254: R13.1 33.44,13.2 Q1.3 32.48,13.29 29.82,13.29 | 29.82,13.29 U6.14 | U6.24 29.32,6.79 29.87,7.34 29.87,13.24 29.82,13.29
!GPIO_DISPLAY_RESET  (via drill 0.3 pad 0.6)
  Top 0.254: U2.41 26.23,23.96 v26.21,23.98
  Route2 0.254: v26.21,23.98 26.77,24.54 26.77,31.24 26.09,31.93 21.31,31.93 20.22,30.84 CN7.5
!SDCARD_CARD_DETECT!  (via drill 0.3 pad 0.5, 0.3 pad 0.6)
  Top 0.254: v23.04,9.55 24.84,9.55 25.23,9.94 U2.18
  Route2 0.254: v23.04,9.55 v14.25,9.55
  Bottom 0.254: R18.2 15.8,8.74 15.51,9.03 CN6.P9 v14.25,9.55
!SPI_DISPLAY_CS  (via drill 0.3 pad 0.6)
  Top 0.254: U2.11 22.71,16.32 24.66,18.28 v24.66,18.29
  Route2 0.254: CN7.7 25.3,30.85 25.03,31.11 22.07,31.11 21.67,30.71 21.67,23.7 24.66,20.7 v24.66,18.29
ADC_BATTERY_VOLTAGE  (via drill 0.3 pad 0.6)
  Top 0.254: U2.12 v23.04,15.82
  Route2 0.254: v23.04,15.82 28.04,15.82 v29.54,14.33
  Bottom 0.254: v29.54,14.33 30.08,14.87 R15.1 R16.2
GPIO_BATTERY_CHARGING_STATUS  (via drill 0.3 pad 0.6)
  Top 0.254: v25.7,17.86 25.73,17.88 U2.42
  Bottom 0.254: U1.1 18.86,17.71 19.07,17.5 25.35,17.5 v25.7,17.86
GPIO_DISPLAY_TRANSMISSION_MODE  (via drill 0.3 pad 0.6)
  Top 0.254: U2.32 29.69,19.3 28.82,19.3 28.4,18.87 v27.3,18.87
  Route2 0.254: v27.3,18.87 22.76,23.42 CN7.6
GPIO_ROTARY_ENCODER_BUTTON  (via drill 0.3 pad 0.6)
  Top 0.254: U2.33 28.13,19.82 v27.91,19.61
  Route2 0.254: v27.91,19.61 28.12,19.81 30.48,19.81 v34.16,23.5
  Bottom 0.254: SW1.SW1 36.5,24.1 35.99,24.61 R21.2 v34.16,23.5
GPIO_ROTARY_ENCODER_SIGNAL_A  (via drill 0.3 pad 0.6)
  Top 0.254: v27.38,20.34 27.41,20.32 U2.34
  Route15 0.254: SW1.A 29.74,18.22 29.74,19.79 29.18,20.34 v27.38,20.34
  Bottom 0.254: SW1.A 38.46,9.84 R22.2
GPIO_ROTARY_ENCODER_SIGNAL_B  (via drill 0.3 pad 0.6)
  Top 0.254: U2.35 28.11,20.82 27.7,21.23 v27.69,21.23
  Route15 0.254: SW1.B 43.54,12.44 35.18,20.8 28.12,20.8 v27.69,21.23
  Bottom 0.254: SW1.B 43.54,10.45 42.82,11.18 R23.2
GPIO_USB_DETECT  (via drill 0.3 pad 0.6)
  Top 0.254: U2.17 24.73,13.4 v24.13,12.8
  Route2 0.254: v24.13,12.8 24.13,4.27 25.58,2.82 46.53,2.82 47.02,3.31 v49.37,3.31
  Bottom 0.254: R1.1 R2.2 v49.37,3.31
I2C_RTC_SCL  (via drill 0.3 pad 0.5, 0.3 pad 0.6)
  Top 0.254: v19.74,24.18 18.7,24.18 R20.2 | U8.16 4.38,27.87 v4.39,27.89 | U2.15 23.73,13.36 23.41,13.05 16.95,13.05 v16.94,13.06
  Route2 0.254: v4.39,27.89 4.39,24.38 4.62,24.16 19.71,24.16 v19.74,24.18
  Route15 0.254: v16.94,13.06 16.94,21.39 v19.74,24.18
I2C_RTC_SDA  (via drill 0.3 pad 0.5, 0.3 pad 0.6)
  Top 0.254: R19.2 18.71,25.76 20.71,25.76 v20.73,25.78 | U2.14 23.23,15.22 24.43,16.43 v25.07,16.43 | U8.15 5.65,27.89 v6.18,28.42
  Route2 0.254: 20.83,25.68 21.23,25.28 21.23,21.82 23.9,19.15 23.9,16.87 24.33,16.43 v25.07,16.43 | 20.83,25.68 v20.73,25.78 | v6.18,28.42 6.18,26.14 6.63,25.68 20.83,25.68
ICSP_SBWTCK  (via drill 0.3 pad 0.6)
  Top 0.254: v19.81,19.96 20.17,20.32 U2.3
  Route15 0.254: v18.31,2.87 18.31,19.23 19.05,19.96 v19.81,19.96
  Bottom 0.254: CN4.4 18.3,2.86 v18.31,2.87
ICSP_SBWTDIO  (via drill 0.3 pad 0.5, 0.3 pad 0.6)
  Top 0.254: U2.2 19.79,20.82 v19.74,20.77
  Route15 0.254: v19.74,20.77 18.8,20.77 17.73,19.7 17.73,4.21 v17.73,4.12 v6.95,4.12
  Bottom 0.254: R17.2 C13.1 6.95,3.2 v6.95,4.12 | v17.73,4.12 15.84,4.12 CN4.6
MCU_!SPI_SDCARD_CS  (via drill 0.3 pad 0.5, 0.3 pad 0.6)
  Top 0.254: U2.7 19.82,18.32 v19.81,18.31
  Route2 0.254: v29.31,11.99 27.15,11.99 24.79,14.35 23.09,14.35 19.81,17.63 v19.81,18.31
  Bottom 0.254: U6.16 v29.3,11.99 v29.31,11.99
MCU_SPI_SDCARD_SCLK  (via drill 0.3 pad 0.6)
  Top 0.254: v19.64,19.19 19.99,19.19 20.36,18.82 U2.6
  Route15 0.254: v19,14.1 19,18.87 19.32,19.19 v19.64,19.19
  Bottom 0.254: U6.11 20.44,13.29 19.63,14.1 v19,14.1
MCU_SPI_SDCARD_SIMO  (via drill 0.3 pad 0.6)
  Top 0.254: U2.4 22.47,19.82 22.66,19.63 v22.66,19.58
  Route15 0.254: v28.91,13.95 25.76,13.95 23.55,16.15 23.55,18.7 v22.66,19.58
  Bottom 0.254: U6.13 v28.91,13.95 | v28.91,13.95
MCU_SPI_SDCARD_SOMI  (via drill 0.3 pad 0.6)
  Top 0.254: U2.5 22.08,19.32 22.45,18.95 v22.45,18.36
  Route2 0.254: v22.45,18.36 22.45,15.62 23.06,15.01 25.2,15.01 27.57,12.64 v28.51,12.64
  Bottom 0.254: U6.15 v28.5,12.64 v28.51,12.64
N$1
  Bottom 0.254: Q2.1 23.1,27.52 22.47,28.15 20.46,28.15 U3.1
N$2  (via drill 0.3 pad 0.6)
  Route2 0.254: v20.12,8.74 13.82,8.74 13.34,9.22 v13.34,12.37
  Bottom 0.254: U6.4 v20.12,8.74 | v13.34,12.37 13.34,13.18 14.1,13.95 CN6.P5
N$3
  Bottom 0.254: Q2.3 Q3.3
N$4
  Bottom 0.254: U5.2 42.73,30.5 CN3.1
N$5
  Bottom 0.254: U4.12 40.9,13.81 41.27,13.44 43.03,13.44 45.16,11.31 LED1.C
N$6  (via drill 0.3 pad 0.5)
  Top 0.254: v40.36,4.32 42.37,4.32 43.04,5 CN1.B5
  Bottom 0.254: R5.1 v40.37,4.31 v40.36,4.32
N$7  (via drill 0.3 pad 0.6)
  Route2 0.254: v23.34,12.45 16.66,19.13 v15.52,19.13
  Bottom 0.254: v23.34,12.45 23.34,12.46 23.16,12.64 U6.10 | CN6.P1 15.51,19.11 v15.52,19.13
N$8
  Bottom 0.254: U6.12 21.36,14.32 19.15,16.54 17.3,16.54 16.59,17.25 CN6.P2
N$9
  Bottom 0.254: LED1.A R14.2
N$10
  Top 0.254: CN1.SHLD3 CN1.SHLD4
  Bottom 0.254: CN1.SHLD2 45.61,3.3 | 45.61,3.3 CN1.SHLD4 | CN1.SHLD3 CN1.SHLD1 | R4.1 C3.2 45.61,3.3
N$11
  Bottom 0.254: C11.2 U4.13 40.26,16.26 41,16.99 42.42,16.99 42.8,16.61 U4.9 42.8,14.84 48.13,14.84 48.39,14.58 C10.2 R11.1 49.02,12.28 49.3,12 49.3,9.36 49.02,9.08 R14.1
N$12
  Bottom 0.254: R12.2 R11.2 45.35,12.28 43.74,13.89 41.8,13.89 41.53,14.17 U4.11
N$13
  Bottom 0.254: C6.2 42.82,20.5 U4.8
N$14
  Bottom 0.254: R9.1 33.52,8.79 Q1.1
N$15  (via drill 0.3 pad 0.5, 0.3 pad 0.6)
  Route2 0.254: v23.37,10.87 23.37,11.48 17.93,16.92 15.16,16.92 v14.4,16.15
  Bottom 0.254: U6.6 22.54,10.04 v23.37,10.87 | CN6.P3 v14.41,16.15 v14.4,16.15
N$16  (via drill 0.3 pad 0.5, 0.3 pad 0.6)
  Route2 0.254: v20.14,10.69 18.57,10.69 17.53,11.73 v14.3,11.73
  Bottom 0.254: U6.7 v20.14,10.7 v20.14,10.69 | CN6.P7 14.31,11.75 v14.3,11.73
N$17  (via drill 0.3 pad 0.5)
  Top 0.254: CN1.A6 41.04,5.59 41.25,5.38 41.88,5.38 42.04,5.54 CN1.B6 42.05,6.5 42.05,11.26 39.57,13.74 v38.99,13.74
  Bottom 0.254: U4.15 v38.99,13.74
N$18  (via drill 0.3 pad 0.5)
  Top 0.254: v38.35,13.13 39.7,11.79 39.7,8.51 40.64,7.57 | CN1.B7 40.54,7.48 40.64,7.57 | CN1.A7 41.54,7.48 41.35,7.68 40.74,7.68 40.64,7.57
  Bottom 0.254: U4.16 v38.36,13.14 v38.35,13.13
N$19  (via drill 0.3 pad 0.5)
  Top 0.254: CN1.A5 40.04,5.11 39.26,4.32 v38.73,4.32
  Bottom 0.254: R6.1 v38.73,4.32
N$20
  Bottom 0.254: U6.9 20.47,11.99 20.33,12.14 20.33,12.87 19.84,13.36 18.59,13.36 15.88,10.65 CN6.P8
N$22  (via drill 0.3 pad 0.5, 0.3 pad 0.6)
  Top 0.254: v22.84,8.2 26.83,8.2 CN5.+ | U8.14 v6.92,19.85 v6.91,19.84
  Route2 0.254: v22.84,8.2 8.48,8.2 6.91,9.78 v6.91,19.84
N$26
  Bottom 0.254: U1.5 18.86,22.84 R3.2
N$27
  Bottom 0.254: U3.3 19.68,25.16 22.2,22.64 22.2,21.82 23.16,20.85 24.66,20.85 25.59,19.93 Q3.1
N$29
  Bottom 0.254: U3.2 20.51,26.42 21.27,27.18 R7.2
N$31
  Bottom 0.254: U3.5 15.79,26.42 R10.2 C7.1
N$32  (via drill 0.3 pad 0.6)
  Top 0.254: CN2.2 4.36,9.13 5.23,10.01 v9.09,10.01
  Route15 0.254: v9.09,10.01 9.09,27.84 9.96,28.7 v13.34,28.7 v16.87,28.7 25.7,28.7 v25.78,28.78
  Bottom 0.254: C7.2 v13.35,28.7 v13.34,28.7 | U3.6 17.18,27.88 16.87,28.2 v16.87,28.7 | Q2.2 25.59,28.59 v25.78,28.78
SPI_DISPLAY_SCLK
  Top 0.254: U2.10 15.89,16.82 13.66,19.05 13.66,24.76 15.14,26.24 CN7.3
SPI_DISPLAY_SIMO
  Top 0.254: CN7.4 17.68,27.74 15.22,25.28 15.22,20.43 18.33,17.32 U2.9
UART_DATALOGGER_RX  (via drill 0.3 pad 0.6)
  Top 0.254: U2.29 30.9,17.82 v31.67,18.59
  Route2 0.254: v47.47,30.73 47.47,26.34 47.07,25.93 38.38,25.93 31.67,19.23 v31.67,18.59
  Bottom 0.254: v47.47,30.73 47.47,31.44 U5.4
USB_CLK  (via drill 0.3 pad 0.6)
  Route2 0.254: v40.26,18.6 40.26,14.16 31.87,5.77 v26.26,5.77
  Bottom 0.254: U4.4 v40.26,18.6 | U6.2 24.58,7.45 v26.26,5.77
USB_CMD  (via drill 0.3 pad 0.6)
  Route2 0.254: v40.9,19.27 40.9,13.49 32.16,4.76 v26.26,4.76
  Bottom 0.254: U4.5 v40.9,19.27 | U6.1 24.23,6.79 v26.26,4.76
USB_DAT0  (via drill 0.3 pad 0.6)
  Route2 0.254: v39.62,19.23 39.62,15.15 31.9,7.43 v28.68,7.43
  Bottom 0.254: U4.3 v39.63,19.24 v39.62,19.23 | U6.23 28.46,7.45 28.48,7.43 v28.68,7.43
USB_DAT1  (via drill 0.3 pad 0.6)
  Route2 0.254: v38.18,18.69 38.18,16.16 30.76,8.74 v28.68,8.74
  Bottom 0.254: U4.2 38.99,19.52 38.17,18.7 v38.18,18.69 | v28.68,8.74 v28.67,8.74 U6.21
USB_DAT2  (via drill 0.3 pad 0.6)
  Route2 0.254: v28.65,10.03 30.73,10.03 37.12,16.42 37.12,22.26 37.57,22.71 41.5,22.71 42.15,22.06 v42.15,19.25
  Bottom 0.254: U4.7 42.15,20.48 v42.15,19.25 | U6.19 28.64,10.04 v28.65,10.03
USB_DAT3  (via drill 0.3 pad 0.6)
  Route2 0.254: v41.51,18.59 41.51,21.53 41.15,21.89 39.32,21.89 38.91,21.49 38.91,15.76 31.24,8.08 v29.21,8.08
  Bottom 0.254: U4.6 41.51,20.46 v41.51,18.59 | v29.21,8.08 29.2,8.1 U6.22
VBAT  (via drill 0.3 pad 0.6)
  Top 0.254: CN2.1 2.36,11.07 3.33,12.04 v9.86,12.04
  Route15 0.254: v9.86,12.04 9.86,18.8 10.85,19.79 v13.11,19.79 13.11,26.55 13.74,27.18 v15.93,27.18
  Bottom 0.254: R10.1 v15.93,27.18 | U7.1 32.64,20.15 32.64,21.13 32.46,21.31 31.01,21.31 30.72,21.02 U7.3 30.72,19.06 30.08,18.42 R15.2 C16.1 C14.1 26.63,17.07 17.55,17.07 16.96,17.66 U1.3 16.96,19.38 16.56,19.79 v13.11,19.79
VUSB  (via drill 0.3 pad 0.5, 0.3 pad 0.6)
  Top 0.254: v48.56,0.91 48.56,2.06 47.22,3.4 v36.14,3.4 | CN1.VBUS1 38.84,7.5 v38.86,7.52 | CN1.VBUS2 43.74,7.49 v43.71,7.52 44.88,8.69 44.88,15.06 43.59,16.36 v42.16,16.36
  Route2 0.254: v14.51,21.06 15.54,21.06 22.94,13.66 24.43,13.66 24.91,13.19 24.91,4.32 25.83,3.4 v36.14,3.4
  Bottom 0.254: R1.2 48.56,1.73 v48.56,0.91 | R8.1 31.91,6.93 33.25,6.93 R9.2 C5.2 33.66,3.4 v36.14,3.4 35.3,3.4 C4.2 35.2,6.19 36.52,7.52 v38.86,7.52 v43.71,7.52 | v42.16,16.36 U4.10 | U1.4 v14.52,21.07 v14.51,21.06
XTAL_IN
  Top 0.254: U2.46 23.73,24.87 Y1.1 25.87,24.89 C8.1
XTAL_OUT
  Top 0.254: U2.47 23.23,23.89 23.09,24.03 22.48,24.03 22.15,24.36 22.15,26.98 22.56,27.39 Y1.2 C9.1

### Text on the board
tPlace: GND | IN